# Altium project project-ui-v1.1.PrjPcb
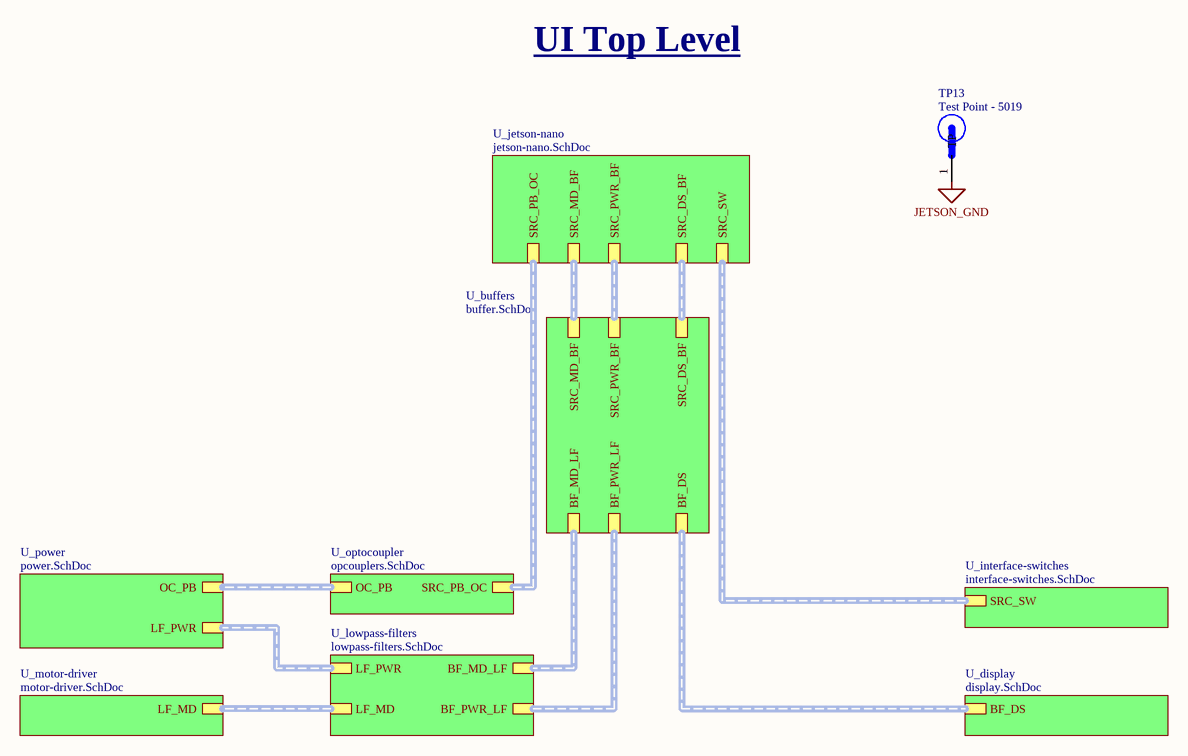
[diagram p0: ui-pcb.SchDoc]
6 sheets, 40 parts. Net scope: hierarchical (ports join the sheet entries above them; power ports are global).
Board file: ui_layout-v1.1.PcbDoc
Sheets:
  ui-pcb.SchDoc
    U_jetson-nano = jetson-nano.SchDoc
    U_lowpass-filters = lowpass-filters.SchDoc
    U_display = display.SchDoc
    U_motor-driver = motor-driver.SchDoc
    U_power = power.SchDoc

## Sheet ui-pcb.SchDoc
size A4; SheetNumber: 1; SheetTotal: 8

### Parts
TP13  Test Point - 5019  [TP380X203]

### Sub-sheets
U_buffers = buffer.SchDoc (file not in this document): SRC_MD_BF (harness MD_SIGNALS), SRC_PWR_BF (harness PWR_SIGNALS), SRC_DS_BF (harness DS_SIGNALS), BF_MD_LF (harness MD_SIGNALS), BF_PWR_LF (harness PWR_SIGNALS), BF_DS (harness DS_SIGNALS)
U_display = display.SchDoc: BF_DS (harness DS_SIGNALS)
U_interface-switches = interface-switches.SchDoc (file not in this document): SRC_SW (harness SW_SIGNALS)
U_jetson-nano = jetson-nano.SchDoc: SRC_DS_BF (harness DS_SIGNALS), SRC_PWR_BF (harness PWR_SIGNALS), SRC_MD_BF (harness MD_SIGNALS), SRC_SW (harness SW_SIGNALS), SRC_PB_OC (harness PB_SIGNALS)
U_lowpass-filters = lowpass-filters.SchDoc: BF_PWR_LF (harness PWR_SIGNALS), LF_PWR (harness PWR_SIGNALS), BF_MD_LF (harness MD_SIGNALS), LF_MD (harness MD_SIGNALS)
U_motor-driver = motor-driver.SchDoc: LF_MD (harness MD_SIGNALS)
U_optocoupler = opcouplers.SchDoc (file not in this document): OC_PB (harness PB_SIGNALS), SRC_PB_OC (harness PB_SIGNALS)
U_power = power.SchDoc: LF_PWR (harness PWR_SIGNALS), OC_PB (harness PB_SIGNALS)

### Nets
JETSON_GND: TP13.1(TP)

### Buses and harness runs
harness sheet U_buffers/BF_DS = sheet U_display/BF_DS
harness sheet U_buffers/BF_MD_LF = sheet U_lowpass-filters/BF_MD_LF
harness sheet U_buffers/BF_PWR_LF = sheet U_lowpass-filters/BF_PWR_LF
harness sheet U_buffers/SRC_DS_BF = sheet U_jetson-nano/SRC_DS_BF
harness sheet U_buffers/SRC_MD_BF = sheet U_jetson-nano/SRC_MD_BF
harness sheet U_buffers/SRC_PWR_BF = sheet U_jetson-nano/SRC_PWR_BF
harness sheet U_interface-switches/SRC_SW = sheet U_jetson-nano/SRC_SW
harness sheet U_jetson-nano/SRC_PB_OC = sheet U_optocoupler/SRC_PB_OC
harness sheet U_lowpass-filters/LF_MD = sheet U_motor-driver/LF_MD
harness sheet U_lowpass-filters/LF_PWR = sheet U_power/LF_PWR
harness sheet U_optocoupler/OC_PB = sheet U_power/OC_PB

### Notes on the sheet
- UI Top Level

### Library data of the parts
TP13 = Test Point - 5019: PC Test Point, Miniature Phosphor Bronze, Silver Plating Surface Mount Mounting Type; MP: 5019; MF: Keystone Electronics; Value: *; Package: 2010 Keystone; Part Number: Test Point - 5019

## Sheet jetson-nano.SchDoc
size A3
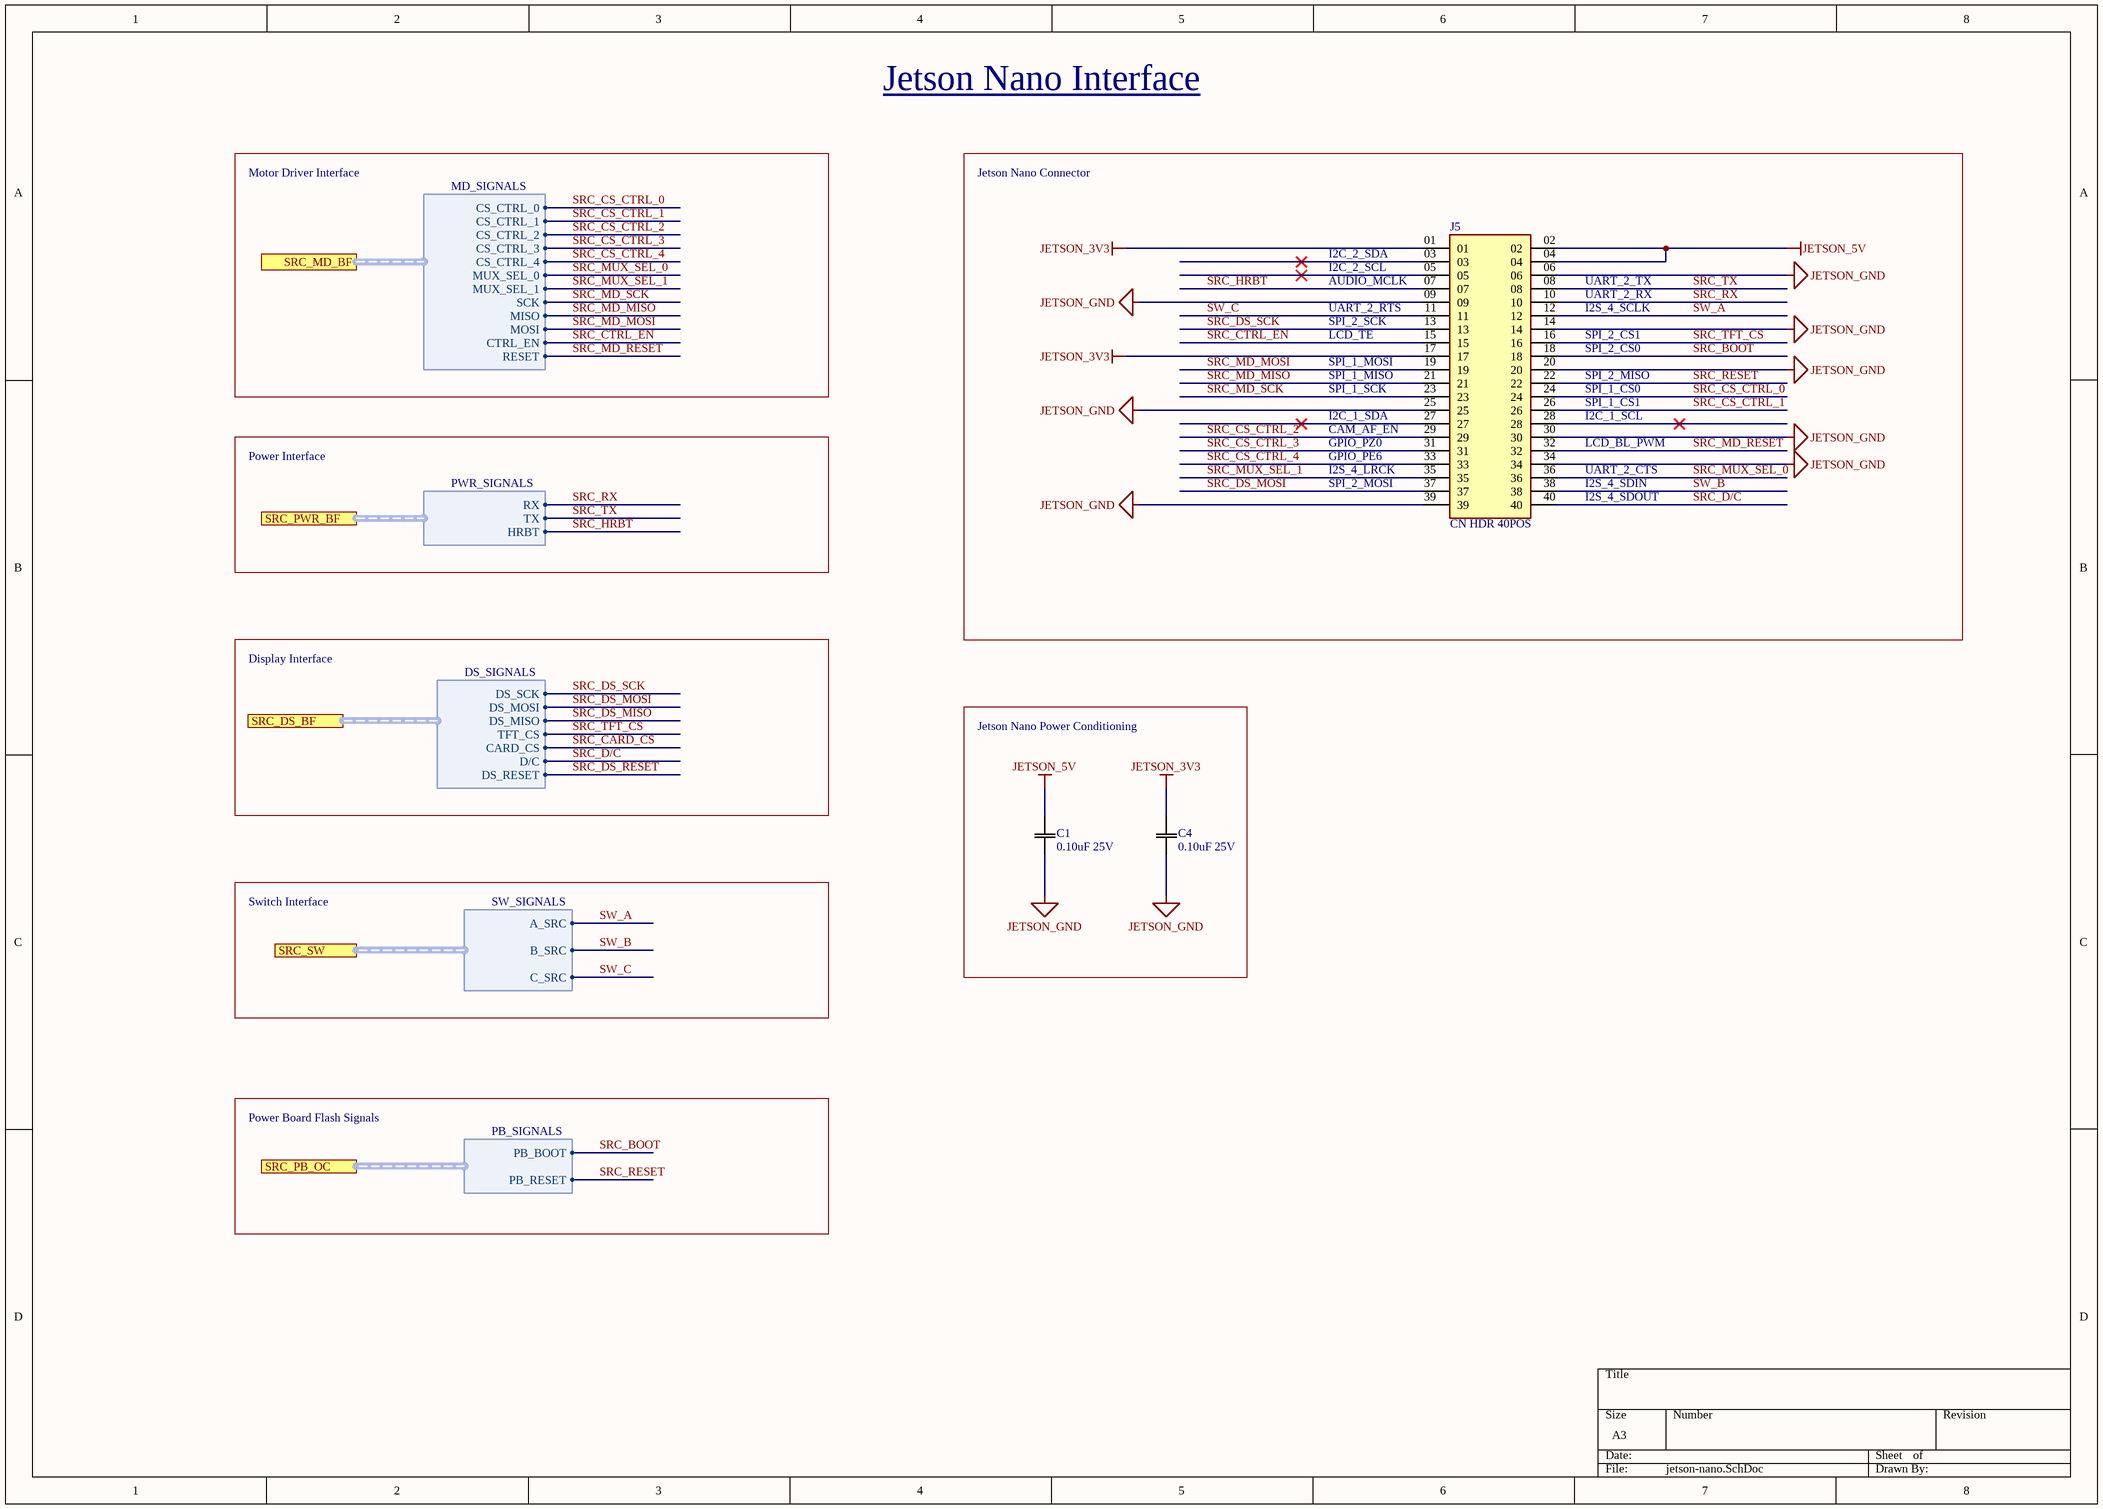
[diagram p1: jetson-nano.SchDoc]

### Parts
C1  0.10uF 25V  [0805]
C4  0.10uF 25V  [0805]
J5  CN HDR 40POS  [CN HDR 40POS 0.1 TH]

### Blocks framed on the sheet
Jetson Nano Power Conditioning: C1 C4

### Ports
SRC_DS_BF (harness DS_SIGNALS), SRC_MD_BF (harness MD_SIGNALS), SRC_PB_OC (harness PB_SIGNALS), SRC_PWR_BF (harness PWR_SIGNALS), SRC_SW (harness SW_SIGNALS)

### Harnesses
PWR_SIGNALS: TX, RX, HRBT
MD_SIGNALS: CS_CTRL_0, MUX_SEL_1, SCK, MOSI, MISO, CS_CTRL_1, CS_CTRL_2, CS_CTRL_3, CS_CTRL_4, MUX_SEL_0, CTRL_EN, RESET
DS_SIGNALS: DS_SCK, DS_MOSI, DS_MISO, TFT_CS, CARD_CS, D/C, DS_RESET
SW_SIGNALS: A_SRC, B_SRC, C_SRC
PB_SIGNALS: PB_BOOT, PB_RESET

### Nets
JETSON_3V3: C4.2(C2) J5.01 J5.17
JETSON_5V: C1.2(C2) J5.02 J5.04
JETSON_GND: C1.1(C1) C4.1(C1) J5.06 J5.09 J5.14 J5.20 J5.25 J5.30 J5.34 J5.39
SRC_BOOT: J5.18 ; port SRC_PB_OC.PB_BOOT
SRC_CARD_CS: port SRC_DS_BF.CARD_CS
SRC_CS_CTRL_0: J5.24 ; port SRC_MD_BF.CS_CTRL_0
SRC_CS_CTRL_1: J5.26 ; port SRC_MD_BF.CS_CTRL_1
SRC_CS_CTRL_2: J5.29 ; port SRC_MD_BF.CS_CTRL_2
SRC_CS_CTRL_3: J5.31 ; port SRC_MD_BF.CS_CTRL_3
SRC_CS_CTRL_4: J5.33 ; port SRC_MD_BF.CS_CTRL_4
SRC_CTRL_EN: J5.15 ; port SRC_MD_BF.CTRL_EN
SRC_D/C: J5.40 ; port SRC_DS_BF.D/C
SRC_DS_MISO: port SRC_DS_BF.DS_MISO
SRC_DS_MOSI: J5.37 ; port SRC_DS_BF.DS_MOSI
SRC_DS_RESET: port SRC_DS_BF.DS_RESET
SRC_DS_SCK: J5.13 ; port SRC_DS_BF.DS_SCK
SRC_HRBT: J5.07 ; port SRC_PWR_BF.HRBT
SRC_MD_MISO: J5.21 ; port SRC_MD_BF.MISO
SRC_MD_MOSI: J5.19 ; port SRC_MD_BF.MOSI
SRC_MD_RESET: J5.32 ; port SRC_MD_BF.RESET
SRC_MD_SCK: J5.23 ; port SRC_MD_BF.SCK
SRC_MUX_SEL_0: J5.36 ; port SRC_MD_BF.MUX_SEL_0
SRC_MUX_SEL_1: J5.35 ; port SRC_MD_BF.MUX_SEL_1
SRC_RESET: J5.22 ; port SRC_PB_OC.PB_RESET
SRC_RX: J5.10 ; port SRC_PWR_BF.RX
SRC_TFT_CS: J5.16 ; port SRC_DS_BF.TFT_CS
SRC_TX: J5.08 ; port SRC_PWR_BF.TX
SW_A: J5.12 ; port SRC_SW.A_SRC
SW_B: J5.38 ; port SRC_SW.B_SRC
SW_C: J5.11 ; port SRC_SW.C_SRC

Not connected (* = marked no-connect by the designer): J5 03* 05* 27* 28*

### Notes on the sheet
- Jetson Nano Interface
- Motor Driver Interface
- Jetson Nano Connector
- AUDIO_MCLK
- UART_2_RTS
- I2C_2_SDA
- I2C_2_SCL
- I2S_4_SCLK
- UART_2_TX
- UART_2_RX
- LCD_TE
- SPI_2_SCK
- SPI_1_MOSI
- SPI_1_MISO
- SPI_2_CS1
- SPI_2_MISO
- SPI_2_CS0
- GPIO_PZ0
- CAM_AF_EN
- SPI_1_SCK
- I2C_1_SDA
- LCD_BL_PWM
- SPI_1_CS0
- SPI_1_CS1
- I2C_1_SCL
- Power Interface
- SPI_2_MOSI
- I2S_4_LRCK
- GPIO_PE6
- I2S_4_SDIN
- UART_2_CTS
- I2S_4_SDOUT
- Display Interface
- Switch Interface
- Power Board Flash Signals

### Library data of the parts
C1 C4 = CAP 0.10uF 25V: CAP CER 0.10UF 25V X7R 0805; Value: 0.1uF; Tolerance: 10%; Temperature Coefficient: X7R; Rating: 25V; Part Number: CAP 0.10uF 25V; Operating Temperature: -55°C ~ 125°C
J5 = CN HDR 40POS: 40 Position Header Connector; Part Number: CN HDR 40POS; Supplier 1: Digi-Key; Supplier Part Number 1: S6104-ND; Supplier URL 1: https://www.digikey.ca/en/products/detail/sullins-connector-solutions/PPTC202LFBN-RC/807240?s=N4IgTCBcDaIMoDYCMAGALAWgHIBEQF0BfIA; Pin Count: 40

## Sheet lowpass-filters.SchDoc
size A3; SheetNumber: 1; SheetTotal: 6
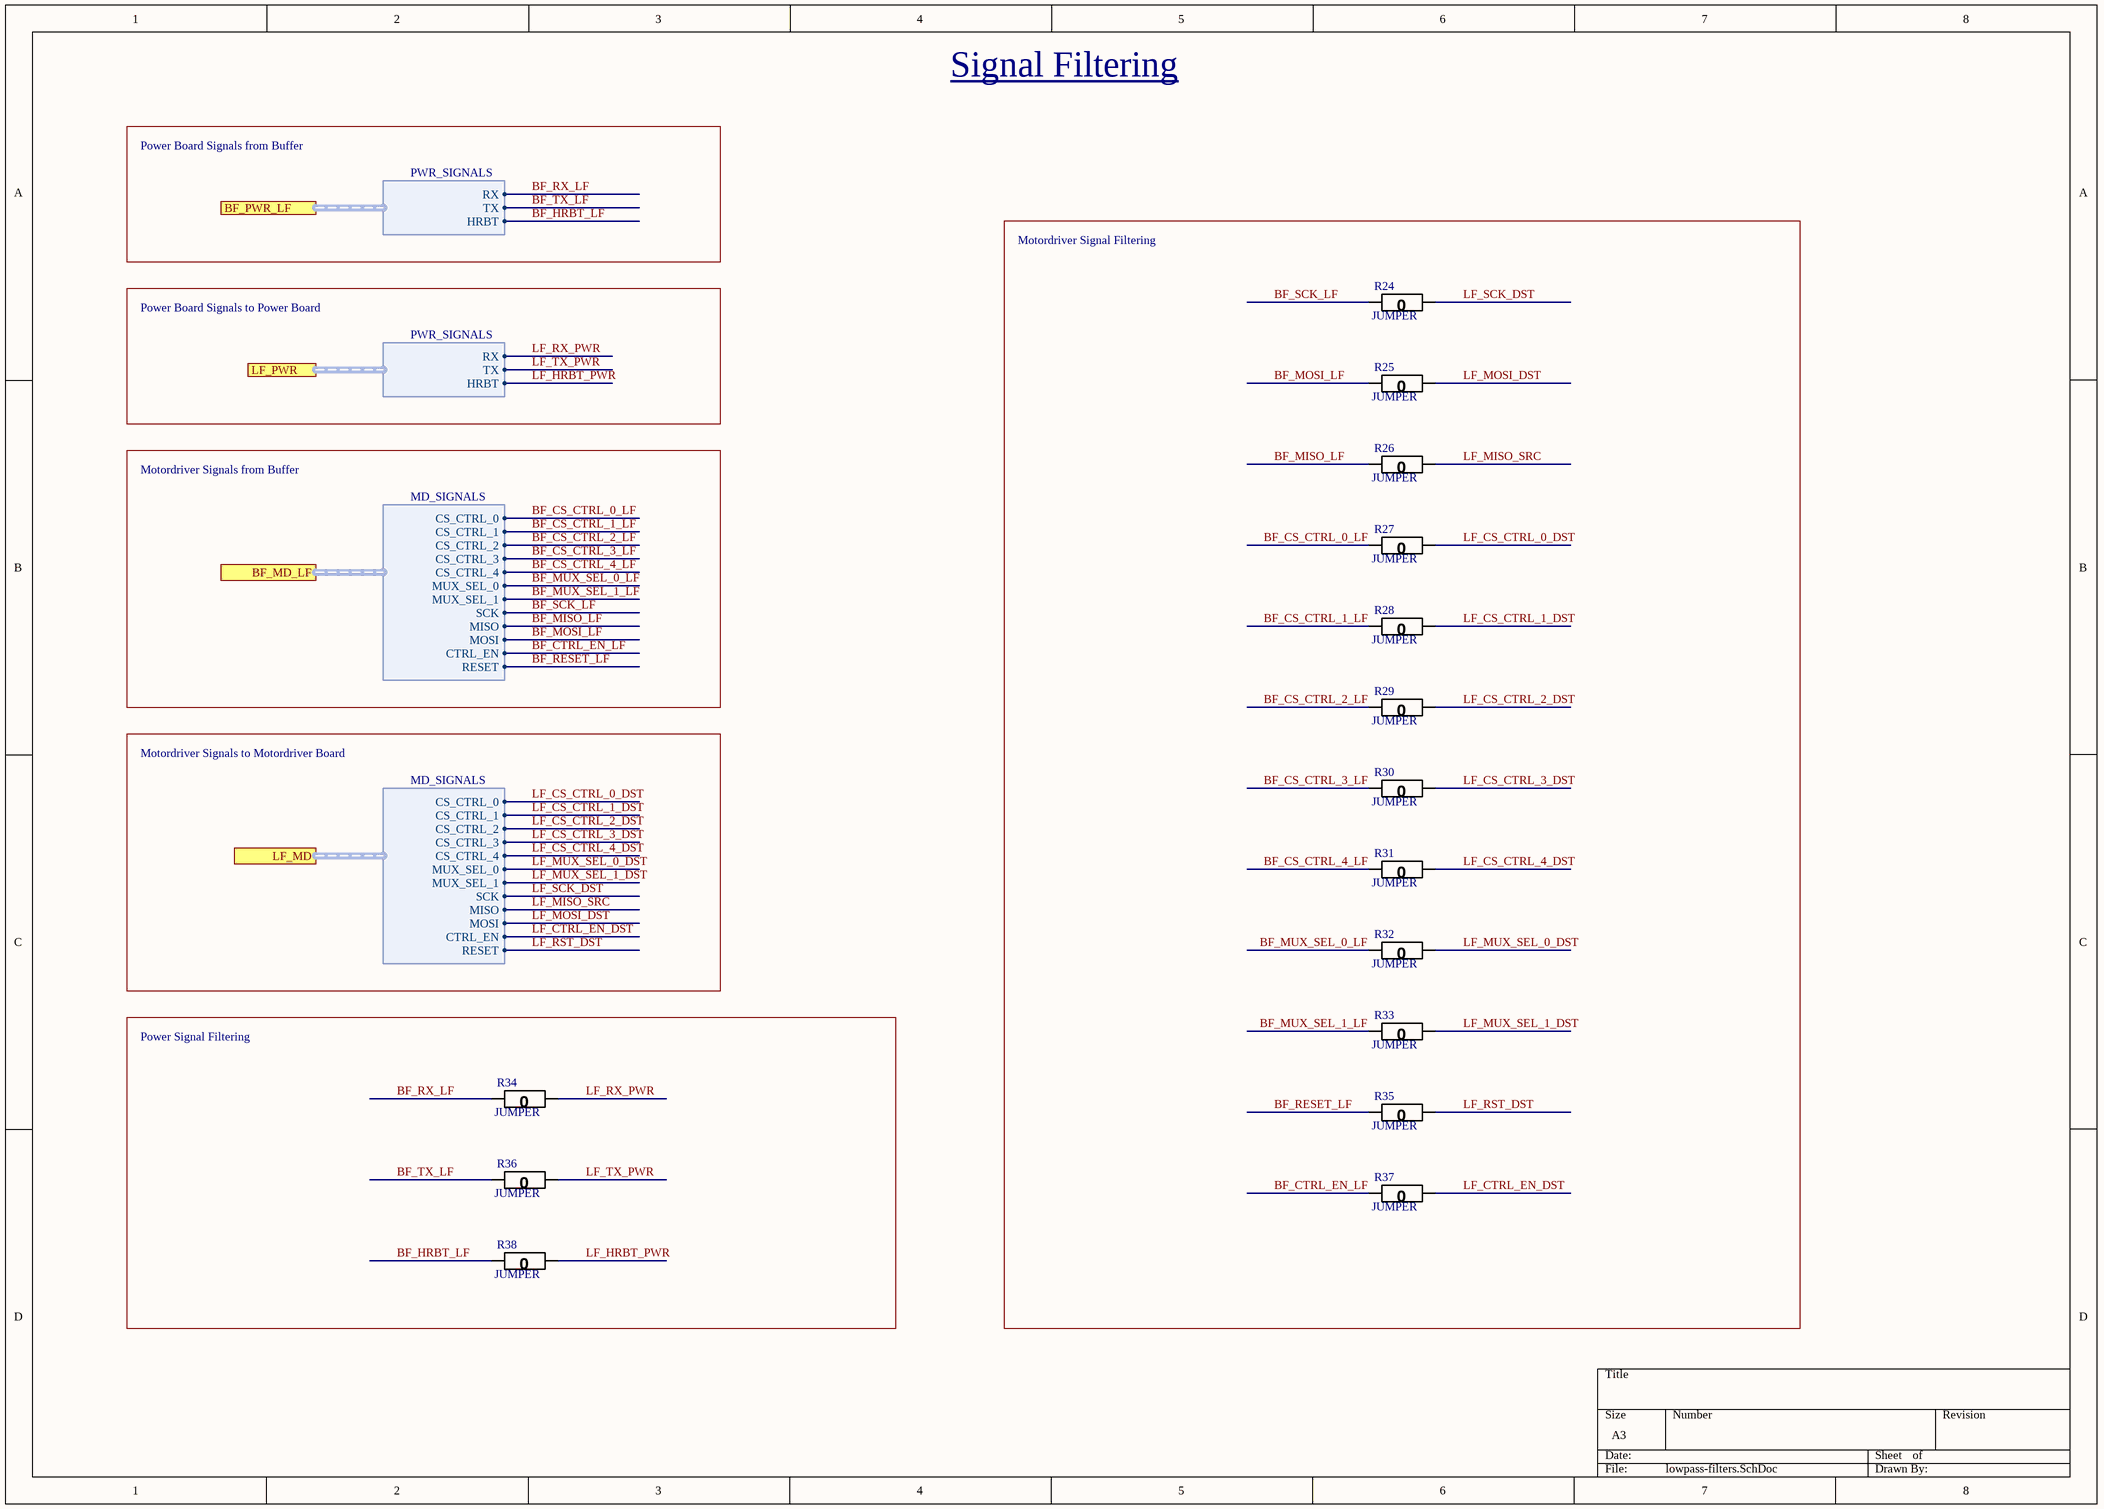
[diagram p2: lowpass-filters.SchDoc]

### Parts
R24  JUMPER  [0603]
R25  JUMPER  [0603]
R26  JUMPER  [0603]
R27  JUMPER  [0603]
R28  JUMPER  [0603]
R29  JUMPER  [0603]
R30  JUMPER  [0603]
R31  JUMPER  [0603]
R32  JUMPER  [0603]
R33  JUMPER  [0603]
R34  JUMPER  [0603]
R35  JUMPER  [0603]
R36  JUMPER  [0603]
R37  JUMPER  [0603]
R38  JUMPER  [0603]

### Blocks framed on the sheet
Motordriver Signal Filtering: R24-R33 R35 R37
Power Signal Filtering: R34 R36 R38

### Ports
BF_MD_LF (harness MD_SIGNALS), BF_PWR_LF (harness PWR_SIGNALS), LF_MD (harness MD_SIGNALS), LF_PWR (harness PWR_SIGNALS)

### Harnesses
PWR_SIGNALS: TX, RX, HRBT
MD_SIGNALS: CS_CTRL_0, MUX_SEL_1, SCK, MOSI, MISO, CS_CTRL_1, CS_CTRL_2, CS_CTRL_3, CS_CTRL_4, MUX_SEL_0, CTRL_EN, RESET

### Nets
BF_CS_CTRL_0_LF: R27.2(R2) ; port BF_MD_LF.CS_CTRL_0
BF_CS_CTRL_1_LF: R28.2(R2) ; port BF_MD_LF.CS_CTRL_1
BF_CS_CTRL_2_LF: R29.2(R2) ; port BF_MD_LF.CS_CTRL_2
BF_CS_CTRL_3_LF: R30.2(R2) ; port BF_MD_LF.CS_CTRL_3
BF_CS_CTRL_4_LF: R31.2(R2) ; port BF_MD_LF.CS_CTRL_4
BF_CTRL_EN_LF: R37.2(R2) ; port BF_MD_LF.CTRL_EN
BF_HRBT_LF: R38.2(R2) ; port BF_PWR_LF.HRBT
BF_MISO_LF: R26.2(R2) ; port BF_MD_LF.MISO
BF_MOSI_LF: R25.2(R2) ; port BF_MD_LF.MOSI
BF_MUX_SEL_0_LF: R32.2(R2) ; port BF_MD_LF.MUX_SEL_0
BF_MUX_SEL_1_LF: R33.2(R2) ; port BF_MD_LF.MUX_SEL_1
BF_RESET_LF: R35.2(R2) ; port BF_MD_LF.RESET
BF_RX_LF: R34.2(R2) ; port BF_PWR_LF.RX
BF_SCK_LF: R24.2(R2) ; port BF_MD_LF.SCK
BF_TX_LF: R36.2(R2) ; port BF_PWR_LF.TX
LF_CS_CTRL_0_DST: R27.1(R1) ; port LF_MD.CS_CTRL_0  [project net CS_CTRL_0]
LF_CS_CTRL_1_DST: R28.1(R1) ; port LF_MD.CS_CTRL_1  [project net CS_CTRL_1]
LF_CS_CTRL_2_DST: R29.1(R1) ; port LF_MD.CS_CTRL_2  [project net CS_CTRL_2]
LF_CS_CTRL_3_DST: R30.1(R1) ; port LF_MD.CS_CTRL_3  [project net CS_CTRL_3]
LF_CS_CTRL_4_DST: R31.1(R1) ; port LF_MD.CS_CTRL_4  [project net CS_CTRL_4]
LF_CTRL_EN_DST: R37.1(R1) ; port LF_MD.CTRL_EN  [project net CTRL_EN]
LF_HRBT_PWR: R38.1(R1) ; port LF_PWR.HRBT  [project net HRBT]
LF_MISO_SRC: R26.1(R1) ; port LF_MD.MISO
LF_MOSI_DST: R25.1(R1) ; port LF_MD.MOSI
LF_MUX_SEL_0_DST: R32.1(R1) ; port LF_MD.MUX_SEL_0
LF_MUX_SEL_1_DST: R33.1(R1) ; port LF_MD.MUX_SEL_1
LF_RST_DST: R35.1(R1) ; port LF_MD.RESET
LF_RX_PWR: R34.1(R1) ; port LF_PWR.RX
LF_SCK_DST: R24.1(R1) ; port LF_MD.SCK
LF_TX_PWR: R36.1(R1) ; port LF_PWR.TX

### Notes on the sheet
- Signal Filtering
- Power Board Signals from Buffer
- Power Board Signals to Power Board
- Motordriver Signals from Buffer
- Motordriver Signals to Motordriver Board

### Library data of the parts
R24-R38 = RES 0 JUMPER: RES SMD 0 OHM JUMPER GENERIC 0603; Manufacturer Part Number 1: RK73Z1JTTD; Value: 0; Package: 0805; Part Number: RES 0 JUMPER; Tolerance: N/A; Supplier 1: Digi-Key; Supplier Part Number 1: 2019-RK73Z1JTTDCT-ND; Supplier URL 1: https://www.digikey.ca/en/products/detail/koa-speer-electronics-inc/RK73Z1JTTD/9845478

## Sheet display.SchDoc
size A4; SheetNumber: 8; SheetTotal: 8
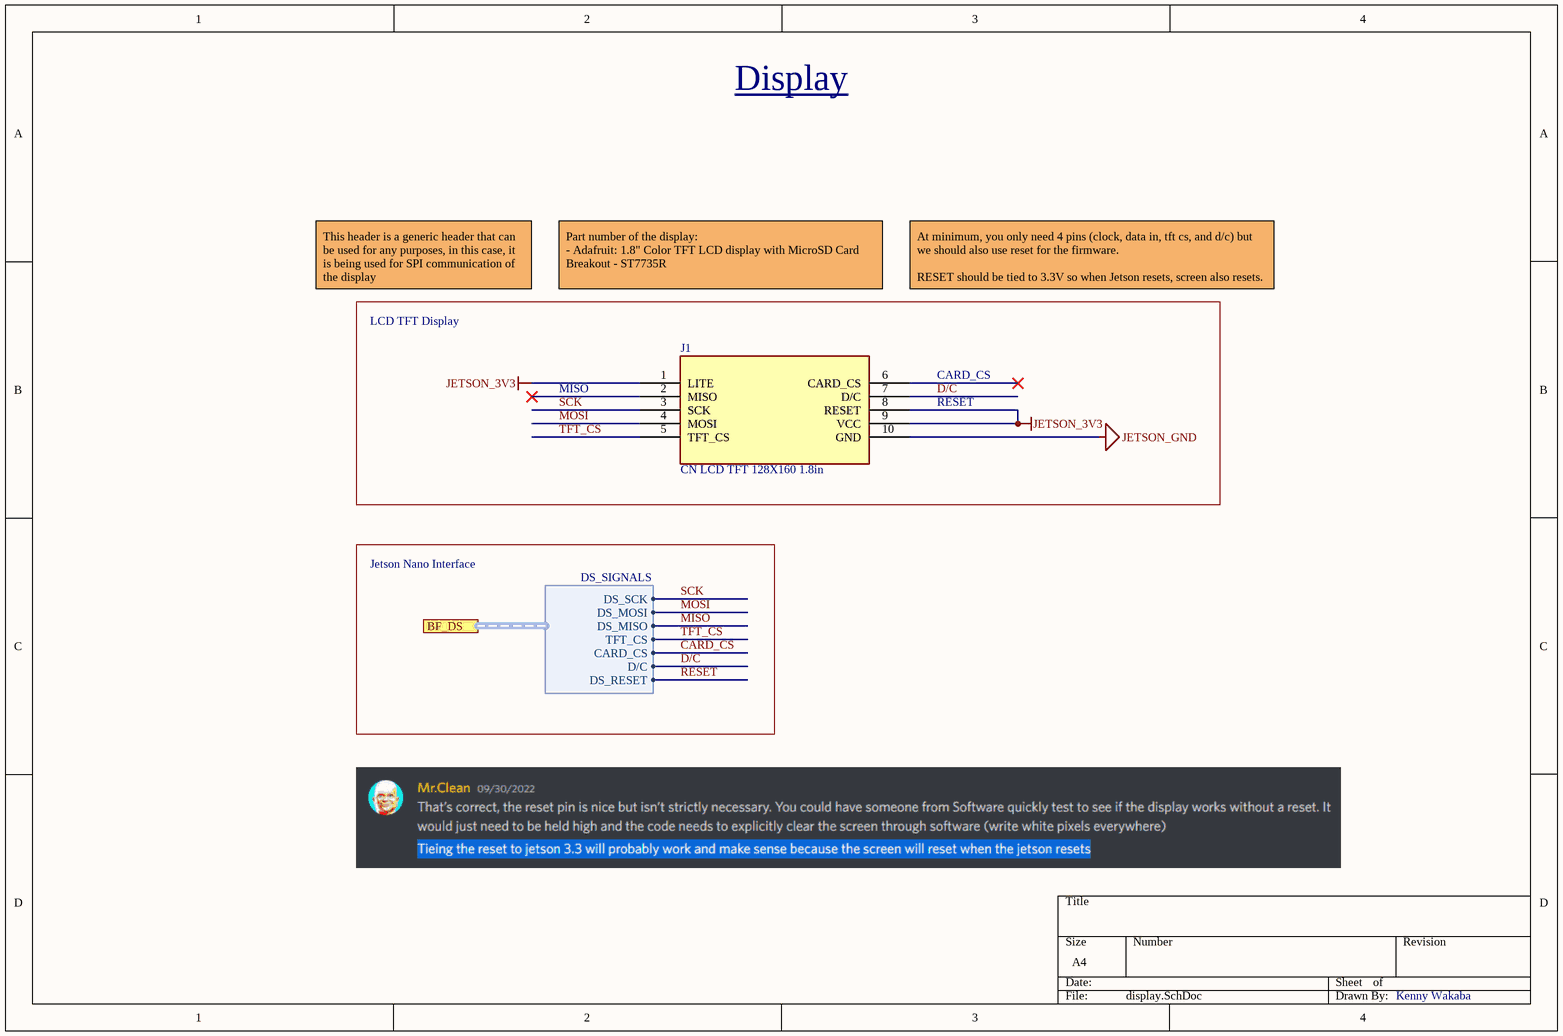
[diagram p3: display.SchDoc]

### Parts
J1  CN LCD TFT 128X160 1.8in  [CN LCD TFT 128X160 1.8in]

### Ports
BF_DS (harness DS_SIGNALS)

### Harnesses
DS_SIGNALS: DS_SCK, DS_MOSI, DS_MISO, TFT_CS, CARD_CS, D/C, DS_RESET

### Nets
JETSON_3V3: J1.1(LITE) J1.8(RESET) J1.9(VCC)
JETSON_GND: J1.10(GND)
CARD_CS: port BF_DS.CARD_CS
D/C: J1.7(D/C) ; port BF_DS.D/C
MISO: port BF_DS.DS_MISO
MOSI: J1.4(MOSI) ; port BF_DS.DS_MOSI
RESET: port BF_DS.DS_RESET
SCK: J1.3(SCK) ; port BF_DS.DS_SCK
TFT_CS: J1.5(TFT_CS) ; port BF_DS.TFT_CS

Not connected (* = marked no-connect by the designer): J1 2(MISO)* 6(CARD_CS)*

### Notes on the sheet
- Display
- This header is a generic header that can be used for any purposes, in this case, it is being used for SPI communication of the display
- Part number of the display:
  - Adafruit: 1.8" Color TFT LCD display with MicroSD Card Breakout - ST7735R
- At minimum, you only need 4 pins (clock, data in, tft cs, and d/c) but we should also use reset for the firmware.
  RESET should be tied to 3.3V so when Jetson resets, screen also resets.
- LCD TFT Display
- CARD_CS
- MISO
- RESET
- Jetson Nano Interface
- Kenny Wakaba

### Library data of the parts
J1 = CN LCD TFT 128X160 1.8in: Graphic LCD Display Module Transmissive Red, Green, Blue (RGB) TFT - Color SPI 1.8" (45.72mm) 128 x 160; Manufacturer Part Number 1: 358; Part Number: CN LCD TFT 128X160 1.8in; Supplier 1: Digi-Key; Supplier Part Number 1: 1528-1536-ND; Supplier URL 1: https://www.digikey.ca/en/products/detail/adafruit-industries-llc/358/5801368; Pin Count: 10

## Sheet motor-driver.SchDoc
size A
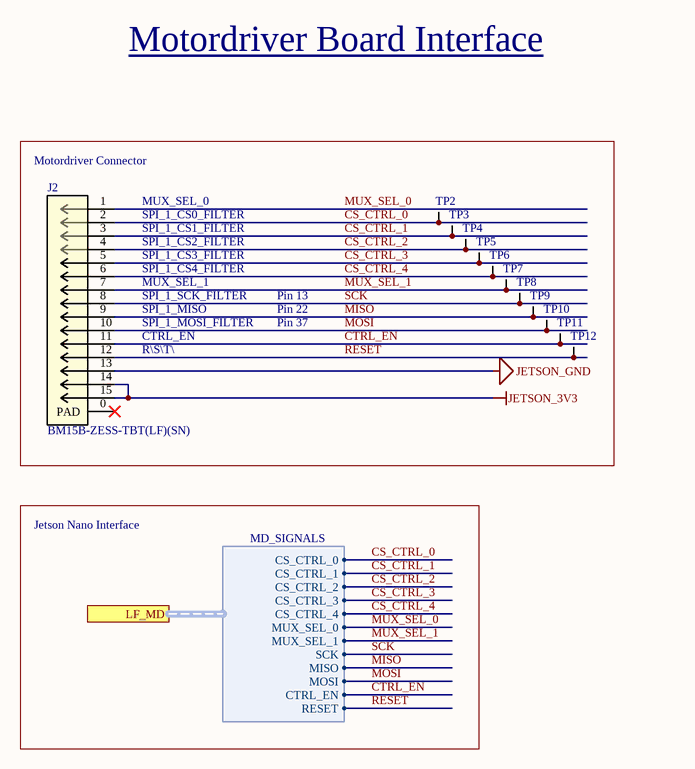
[diagram p4: motor-driver.SchDoc]

### Parts
J2  BM15B-ZESS-TBT(LF)(SN)  [JST ZE SMT 15POS]
TP2  Test Point (Via)  [TP]  (value not drawn)  (no BOM)
TP3  Test Point (Via)  [TP]  (value not drawn)  (no BOM)
TP4  Test Point (Via)  [TP]  (value not drawn)  (no BOM)
TP5  Test Point (Via)  [TP]  (value not drawn)  (no BOM)
TP6  Test Point (Via)  [TP]  (value not drawn)  (no BOM)
TP7  Test Point (Via)  [TP]  (value not drawn)  (no BOM)
TP8  Test Point (Via)  [TP]  (value not drawn)  (no BOM)
TP9  Test Point (Via)  [TP]  (value not drawn)  (no BOM)
TP10  Test Point (Via)  [TP]  (value not drawn)  (no BOM)
TP11  Test Point (Via)  [TP]  (value not drawn)  (no BOM)
TP12  Test Point (Via)  [TP]  (value not drawn)  (no BOM)

### Ports
LF_MD (harness MD_SIGNALS)

### Harnesses
MD_SIGNALS: CS_CTRL_0, MUX_SEL_1, SCK, MOSI, MISO, CS_CTRL_1, CS_CTRL_2, CS_CTRL_3, CS_CTRL_4, MUX_SEL_0, CTRL_EN, RESET

### Nets
JETSON_3V3: J2.14 J2.15
JETSON_GND: J2.13
CS_CTRL_0: J2.2 TP2.1 ; port LF_MD.CS_CTRL_0
CS_CTRL_1: J2.3 TP3.1 ; port LF_MD.CS_CTRL_1
CS_CTRL_2: J2.4 TP4.1 ; port LF_MD.CS_CTRL_2
CS_CTRL_3: J2.5 TP5.1 ; port LF_MD.CS_CTRL_3
CS_CTRL_4: J2.6 TP6.1 ; port LF_MD.CS_CTRL_4
CTRL_EN: J2.11 TP11.1 ; port LF_MD.CTRL_EN
MISO: J2.9 TP9.1 ; port LF_MD.MISO  [project net LF_MISO_SRC]
MOSI: J2.10 TP10.1 ; port LF_MD.MOSI  [project net LF_MOSI_DST]
MUX_SEL_0: J2.1 ; port LF_MD.MUX_SEL_0  [project net LF_MUX_SEL_0_DST]
MUX_SEL_1: J2.7 TP7.1 ; port LF_MD.MUX_SEL_1  [project net LF_MUX_SEL_1_DST]
RESET: J2.12 TP12.1 ; port LF_MD.RESET  [project net LF_RST_DST]
SCK: J2.8 TP8.1 ; port LF_MD.SCK  [project net LF_SCK_DST]

Not connected (* = marked no-connect by the designer): J2 0(PAD)*

### Notes on the sheet
- Motordriver Board Interface
- (near J2) Motordriver Connector
- MUX_SEL_0
- SPI_1_CS0_FILTER
- SPI_1_CS1_FILTER
- SPI_1_CS2_FILTER
- SPI_1_CS3_FILTER
- SPI_1_CS4_FILTER
- CTRL_EN
- SPI_1_SCK_FILTER
- SPI_1_MISO
- SPI_1_MOSI_FILTER
- MUX_SEL_1
- Pin 37
- Pin 22
- Pin 13
- R\S\T\
- Jetson Nano Interface

### Library data of the parts
J2 = CN 15POS JST ZE SMT: CONN HEADER VERT SMD 15POS ZE; Supplier 1: Digi-Key; Supplier Part Number 1: 455-4211-1-ND; Part Number: CN 15POS JST ZE SMT; Manufacturer Part Number 1: BM15B-ZESS-TBT(LF)(SN); Supplier URL 1: https://www.digikey.ca/en/products/detail/jst-sales-america-inc/BM15B-ZESS-TBT-LF-SN/1886999?s=N4IgTCBcDaIEIFkCMBWOBaAWgUQMq-QBU5CAKAGQDEBKU3AOWpAF0BfIA; Pin Count: 15
TP2-TP12 = Test Point (Via): Part Number: Test Point (Via)

## Sheet power.SchDoc
size A4; SheetNumber: 3; SheetTotal: 4
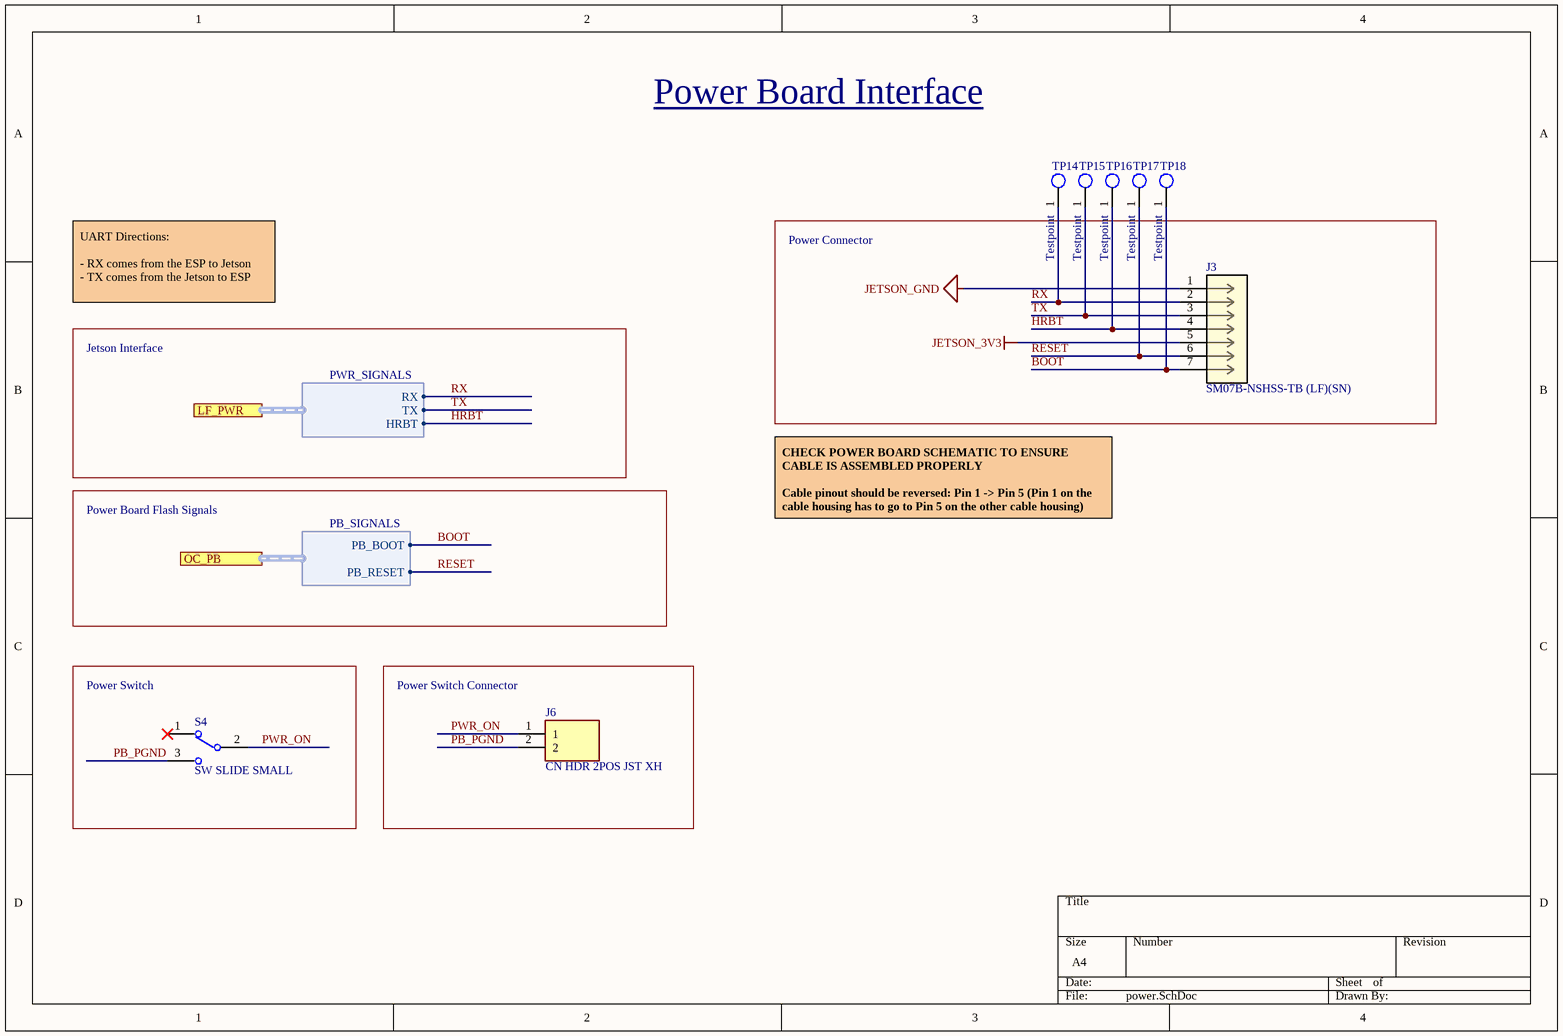
[diagram p5: power.SchDoc]

### Parts
J3  SM07B-NSHSS-TB (LF)(SN)  [JST_SM07B-NSHSS-TB_(LF)(SN)]
J6  CN HDR 2POS JST XH  [JST_B2B-XH-A(LF)(SN)]
S4  SW SLIDE SMALL  [SW SLIDE SMALL]
TP14  Testpoint  [TP_1mm]
TP15  Testpoint  [TP_1mm]
TP16  Testpoint  [TP_1mm]
TP17  Testpoint  [TP_1mm]
TP18  Testpoint  [TP_1mm]

### Blocks framed on the sheet
Power Connector: J3
Power Switch: S4
Power Switch Connector: J6

### Ports
LF_PWR (harness PWR_SIGNALS), OC_PB (harness PB_SIGNALS)

### Harnesses
PWR_SIGNALS: TX, RX, HRBT
PB_SIGNALS: PB_BOOT, PB_RESET

### Nets
JETSON_3V3: J3.5
JETSON_GND: J3.1
BOOT: J3.7 TP18.1(TP) ; port OC_PB.PB_BOOT
HRBT: J3.4 TP16.1(TP) ; port LF_PWR.HRBT
PB_PGND: J6.2 S4.3
PWR_ON: J6.1 S4.2
RESET: J3.6 TP17.1(TP) ; port OC_PB.PB_RESET
RX: J3.2 TP14.1(TP) ; port LF_PWR.RX  [project net LF_RX_PWR]
TX: J3.3 TP15.1(TP) ; port LF_PWR.TX  [project net LF_TX_PWR]

Not connected (* = marked no-connect by the designer): S4 1*

### Notes on the sheet
- Power Board Interface
- UART Directions:
  - RX comes from the ESP to Jetson
  - TX comes from the Jetson to ESP
- Jetson Interface
- Power Board Flash Signals
- CHECK POWER BOARD SCHEMATIC TO ENSURE CABLE IS ASSEMBLED PROPERLY
  Cable pinout should be reversed: Pin 1 -> Pin 5 (Pin 1 on the cable housing has to go to Pin 5 on the other cable housing)

### Library data of the parts
J3 = CN 7POS JST NSH SMT RA: Connector Header Surface Mount, Right Angle 7 position 0.039" (1.00mm); MP: SM12B-NSHSS-TB (LF)(SN); MF: JST Sales America Inc.; Package: None; Check_prices: https://www.snapeda.com/parts/SM12B-NSHSS-TB%20(LF)(SN)/JST%20Sales%20America%20Inc./view-part/5255521/?ref=eda; Value: *; Availability: Unavailable; Price: None; SnapEDA_Link: https://www.snapeda.com/parts/SM12B-NSHSS-TB%20(LF)(SN)/JST%20Sales%20America%20Inc./view-part/5255521/?ref=snap; Supplier 1: Digi-Key; Supplier 2: Digi-Key; Supplier 3: Digi-Key; Supplier 4: Digi-Key; Supplier Part Number 1: 455-2771-1-ND; Supplier Part Number 2: 455-2771-1-ND; Supplier Part Number 3: 455-2771-6-ND; Supplier Part Number 4: 455-2771-2-ND; Part Number: CN 7POS JST NSH SMT RA; Supplier URL 1: https://www.digikey.ca/en/products/detail/jst-sales-america-inc/SM07B-NSHSS-TB-LF-SN/3313637; Pin Count: 7
J6 = CN HDR 2POS JST XH: Connector Header Through Hole 2 position 0.098 _2.50mm_ / JST XH; MP: B2B-XH-A_LF__SN_; MF: JST Sales; Price: None; Package: None; Value: *; SnapEDA_Link: https://www.snapeda.com/parts/B2B-XH-A%28LF%29%28SN%29/JST%20Sales%20America%20Inc./view-part/492310/?ref=snap; Part Number: CN HDR 2POS JST XH; Pin Count: 2
S4 = SW SLIDE SMALL: Slide Switch SPDT Surface Mount, Right Angle; Manufacturer Part Number 1: JS102011SAQN SPDT; MF: C&K; MP: JS102011SAQN; Availability: Unavailable; Price: None; SnapEDA_Link: https://www.snapeda.com/parts/JS102011SAQN/C%26K/view-part/214325/?ref=snap; Value: *; Package: None; Part Number: SW SLIDE SMALL; Supplier 1: Digi-key; Supplier Part Number 1: JS102011SAQN SPDT; Supplier URL 1: https://www.digikey.ca/en/products/detail/c-k/JS102011SAQN/1640095
TP14-TP18 = TP_1MM: Part Number: TP_1MM

## Nets that join several sheets
JETSON_3V3: jetson-nano (C4.2 J5.01 J5.17), display (J1.1 J1.8 J1.9), motor-driver (J2.14 J2.15), power (J3.5)
JETSON_GND: ui-pcb (TP13.1), jetson-nano (10 pins), display (J1.10), motor-driver (J2.13), power (J3.1)
CS_CTRL_0: lowpass-filters (R27.1), motor-driver (J2.2 TP2.1)
CS_CTRL_1: lowpass-filters (R28.1), motor-driver (J2.3 TP3.1)
CS_CTRL_2: lowpass-filters (R29.1), motor-driver (J2.4 TP4.1)
CS_CTRL_3: lowpass-filters (R30.1), motor-driver (J2.5 TP5.1)
CS_CTRL_4: lowpass-filters (R31.1), motor-driver (J2.6 TP6.1)
CTRL_EN: lowpass-filters (R37.1), motor-driver (J2.11 TP11.1)
HRBT: lowpass-filters (R38.1), power (J3.4 TP16.1)
LF_MISO_SRC: lowpass-filters (R26.1), motor-driver (J2.9 TP9.1)
LF_MOSI_DST: lowpass-filters (R25.1), motor-driver (J2.10 TP10.1)
LF_MUX_SEL_0_DST: lowpass-filters (R32.1), motor-driver (J2.1)
LF_MUX_SEL_1_DST: lowpass-filters (R33.1), motor-driver (J2.7 TP7.1)
LF_RST_DST: lowpass-filters (R35.1), motor-driver (J2.12 TP12.1)
LF_RX_PWR: lowpass-filters (R34.1), power (J3.2 TP14.1)
LF_SCK_DST: lowpass-filters (R24.1), motor-driver (J2.8 TP8.1)
LF_TX_PWR: lowpass-filters (R36.1), power (J3.3 TP15.1)

## Assembly variants
No FL: not fitted C6_14A C6_14B C6_14C C6_14D C6_14E C6_14F C6_14G C6_14H C6_14I C6_14J C6_14K C6_14L C6_14M C6_14N C6_14O; alternate parts R4_14G -> RES 0 JUMPER, R4_14F -> RES 0 JUMPER, R4_14E -> RES 0 JUMPER, R4_14D -> RES 0 JUMPER, R4_14C -> RES 0 JUMPER, R4_14B -> RES 0 JUMPER, R4_14A -> RES 0 JUMPER, R4_14H -> RES 0 JUMPER, R4_14I -> RES 0 JUMPER, R4_14J -> RES 0 JUMPER, R4_14K -> RES 0 JUMPER, R4_14L -> RES 0 JUMPER, R4_14M -> RES 0 JUMPER, R4_14N -> RES 0 JUMPER, R4_14O -> RES 0 JUMPER